# Altium schematic sheet MachSacXa.SchDoc
size A2
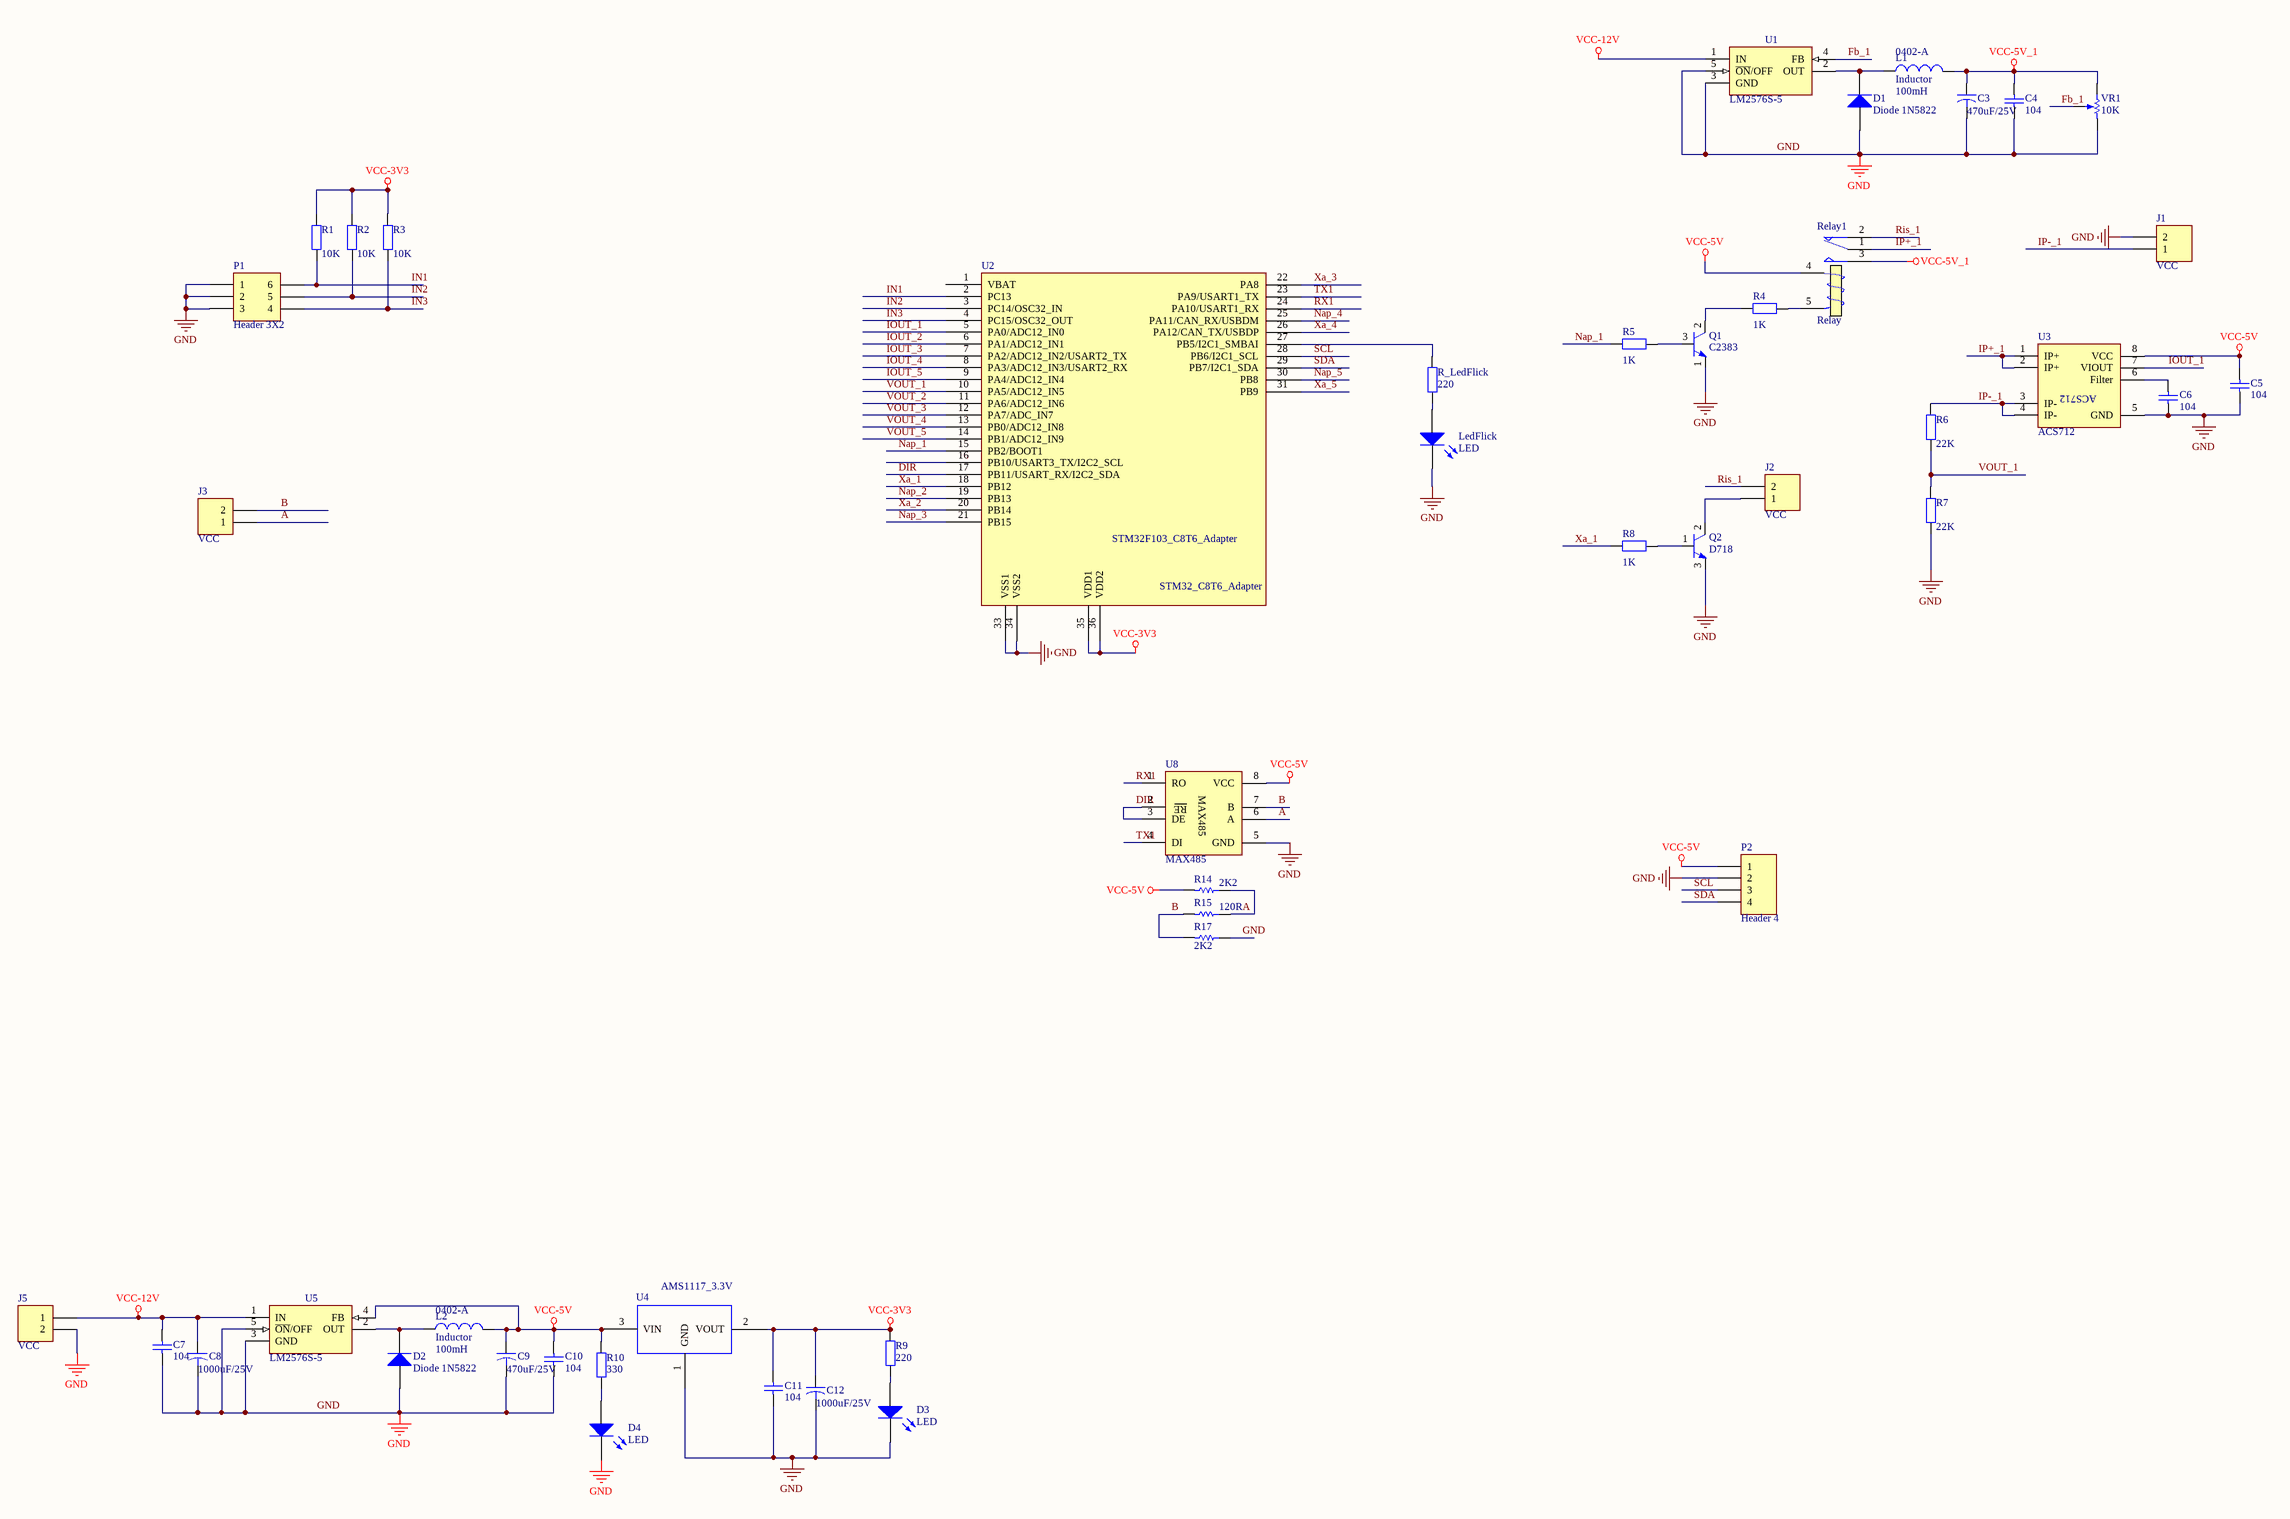
[diagram p0: MachSacXa.SchDoc]

## Parts
C3  value 470uF/25V  [C_D300]
C4  104  [R/C_0805]
C5  104  [R/C_0805]
C6  104  [R/C_0805]
C7  104  [R/C_0805]
C8  value 1000uF/25V  [C_D300]
C9  value 470uF/25V  [C_D300]
C10  104  [R/C_0805]
C11  104  [R/C_0805]
C12  value 1000uF/25V  [C_D300]
D1  Diode 1N5822  [Diode_1A]
D2  Diode 1N5822  [Diode_1A]
D3  LED  [LED_SMD (0805)]
D4  LED  [LED_SMD (0805)]
J1  VCC  [HEADER1_2(400)]
J2  VCC  [HEADER1_2(400)]
J3  VCC  [HEADER1_2(400)]
J5  VCC  [HEADER1_2(400)]
L1  Inductor  value 100mH  PackageReference: 0402-A  [Cuon_cam(100mH)]
L2  Inductor  value 100mH  PackageReference: 0402-A  [Cuon_cam(100mH)]
LedFlick  LED  [LED_SMD (0805)]
P1  Header 3X2  [DIP6_300]
P2  Header 4  [CON-Trang1_4]
Q1  value C2383  [C1815/C945]  (hidden comment: TR_NPN_ECB)
Q2  value D718  [D718]  (hidden comment: TR_NPN_D718)
R1  value 10K  [R/C_0805]
R2  value 10K  [R/C_0805]
R3  value 10K  [R/C_0805]
R4  value 1K  [R/C_0805]
R5  value 1K  [R/C_0805]
R6  value 22K  [R/C_0805]
R7  value 22K  [R/C_0805]
R8  value 1K  [R/C_0805]
R9  value 220  [R/C_0805]
R10  value 330  [R/C_0805]
R14  value 2K2  [R/C_0805]  (hidden comment: Res1)
R15  value 120R  [R/C_0805]  (hidden comment: Res1)
R17  value 2K2  [R/C_0805]  (hidden comment: Res1)
R_LedFlick  value 220  [R/C_0805]
Relay1  Relay  [RL5P_12V7A]
U1  LM2576S-5  [LM2576]
U2  STM32F103_C8T6_Adapter  [Dip36(9x4)]
U3  ACS712  [DS1307]
U4  AMS1117_3.3V  [AMS1117_(SOT_223)]
U5  LM2576S-5  [LM2576]
U8  MAX485  [DIP8_300]
VR1  value 10K  [VR_3]  (hidden comment: Bien tro)

## Nets
GND: C3.2 C4.2 C5.2 C6.2 C7.2 C8.2 C9.2 C10.2 C11.2 C12.2 D1.1(A) D2.1(A) D3.2(K) D4.2(K) J1.2 J5.2 LedFlick.2(K) P1.1 P1.2 P1.3 P2.2 Q1.1(E) Q2.3(B) R7.1 R17.1 U1.3(GND) U1.5(~{ON}/OFF) U2.33(VSS1) U2.34(VSS2) U3.5(GND) U4.1(GND) U5.3(GND) U5.5(~{ON}/OFF) U8.5(GND) VR1.3(TAP)
VCC-3V3: C11.1 C12.1 R1.2 R2.2 R3.2 R9.1 U2.35(VDD1) U2.36(VDD2) U4.2(VOUT)
VCC-5V: C5.1 C9.1 C10.1 L2.2 P2.1 R10.1 R14.2 Relay1.4(T1) U3.8(VCC) U4.3(VIN) U5.4(FB) U8.8(VCC)
VCC-5V_1: C3.1 C4.1 L1.2 Relay1.3(NO) VR1.1(TOP)
VCC-12V: C7.1 C8.1 J5.1 U1.1(IN) U5.1(IN)
A: J3.1 R14.1 R15.1 U8.6(A)
B: J3.2 R15.2 R17.2 U8.7(B)
DIR: U2.17(PB11/USART_RX/I2C2_SDA) U8.2 U8.3(DE)
Fb_1: U1.4(FB) VR1.2(BOT)
IN1: P1.6 R1.1 U2.2(PC13)
IN2: P1.5 R2.1 U2.3(PC14/OSC32_IN)
IN3: P1.4 R3.1 U2.4(PC15/OSC32_OUT)
IOUT_1: U2.5(PA0/ADC12_IN0) U3.7(VIOUT)
IOUT_2: U2.6(PA1/ADC12_IN1)
IOUT_3: U2.7(PA2/ADC12_IN2/USART2_TX)
IOUT_4: U2.8(PA3/ADC12_IN3/USART2_RX)
IOUT_5: U2.9(PA4/ADC12_IN4)
IP+_1: Relay1.1(COM) U3.1(IP+) U3.2(IP+)
IP-_1: J1.1 R6.2 U3.3(IP-) U3.4(IP-)
Nap_1: R5.1 U2.15(PB2/BOOT1)
Nap_2: U2.19(PB13)
Nap_3: U2.21(PB15)
Nap_4: U2.25(PA11/CAN_RX/USBDM)
Nap_5: U2.30(PB8)
Ris_1: J2.2 Relay1.2(NC)
RX1: U2.24(PA10/USART1_RX) U8.1(RO)
SCL: P2.3 U2.28(PB6/I2C1_SCL)
SDA: P2.4 U2.29(PB7/I2C1_SDA)
TX1: U2.23(PA9/USART1_TX) U8.4(DI)
VOUT_1: R6.1 R7.2 U2.10(PA5/ADC12_IN5)
VOUT_2: U2.11(PA6/ADC12_IN6)
VOUT_3: U2.12(PA7/ADC_IN7)
VOUT_4: U2.13(PB0/ADC12_IN8)
VOUT_5: U2.14(PB1/ADC12_IN9)
Xa_1: R8.1 U2.18(PB12)
Xa_2: U2.20(PB14)
Xa_3: U2.22(PA8)
Xa_4: U2.26(PA12/CAN_TX/USBDP)
Xa_5: U2.31(PB9)
NetC6_1: C6.1 U3.6(Filter)
NetD1_2: D1.2(K) L1.1 U1.2(OUT)
NetD2_2: D2.2(K) L2.1 U5.2(OUT)
NetD3_1: D3.1(A) R9.2
NetD4_1: D4.1(A) R10.2
NetJ2_1: J2.1 Q2.2(C)
NetLedFlick_1: LedFlick.1(A) R_LedFlick.2
NetQ1_2: Q1.2(C) R4.1
NetQ1_3: Q1.3(B) R5.2
NetQ2_1: Q2.1(E) R8.2
NetR4_2: R4.2 Relay1.5(T2)
NetR_LedFlick_1: R_LedFlick.1 U2.27(PB5/I2C1_SMBAI)

Not connected (* = marked no-connect by the designer): U2 1(VBAT) 16(PB10/USART3_TX/I2C2_SCL)

## Notes on the sheet
- (in symbol MAX485) RE

## Library data of the parts
C3 C8 C9 C12 = Cap2: Capacitor; Published: 23-Sep-2002; PackageReference: CAPR5-4X5; Publisher: Altium Limited
C4-C7 C10 C11 = Cap: Capacitor; Value: 100pF; Published: 8-Jun-2000; LatestRevisionDate: 17-Jul-2002; LatestRevisionNote: Re-released for DXP Platform.; PackageReference: RAD-0.3; Publisher: Altium Limited
D1 D2 = Diode 1N4004: 1 Amp General Purpose Rectifier; Published: 8-Jun-2000; LatestRevisionDate: 17-Jul-2002; LatestRevisionNote: Re-released for DXP Platform.; DatasheetDocument: 1998; PackageDocument: Aug-1999; PackageReference: DO-41; Publisher: Altium Limited; Code_JEDEC: DO-204-AL; ComponentLink1Description: Manufacturer Link; ComponentLink1URL: http://www.fairchildsemi.com/; ComponentLink2Description: Datasheet; ComponentLink2URL: http://www.fairchildsemi.com/ds/1N%2F1N4001.pdf
D3 D4 LedFlick = LED0: Typical INFRARED GaAs LED; Published: 8-Jun-2000; LatestRevisionDate: 08-Jul-2005; LatestRevisionNote: Mech Layer 1 removed.; PackageReference: LED-0; Publisher: Altium Limited
J1-J3 J5 = Header 2: Header, 2-Pin; LatestRevisionDate: 17-Jul-2002; LatestRevisionNote: Re-released for DXP Platform.; Publisher: Altium Limited
L1 L2 = Inductor: Code_IEC: 1005; Published: 8-Jun-2000; LatestRevisionDate: 17-Jul-2002; LatestRevisionNote: Re-released for DXP Platform.; Publisher: Altium Limited; Code_JEITA: 0402
P1 = Header 3X2: Header, 3-Pin, Dual row; LatestRevisionDate: 17-Jul-2002; LatestRevisionNote: Re-released for DXP Platform.; Publisher: Altium Limited
P2 = Header 4: Header, 4-Pin; LatestRevisionDate: 17-Jul-2002; LatestRevisionNote: Re-released for DXP Platform.; Publisher: Altium Limited
R1-R10 R_LedFlick = Res2: Resistor; Published: 8-Jun-2000; LatestRevisionDate: 17-Jul-2002; LatestRevisionNote: Re-released for DXP Platform.; PackageReference: AXIAL-0.4; Publisher: Altium Limited
R14 R15 R17 = Res1: Resistor; Published: 8-Jun-2000; LatestRevisionDate: 17-Jul-2002; LatestRevisionNote: Re-released for DXP Platform.; PackageReference: AXIAL-0.3; Publisher: Altium Limited
Relay1 = Relay: SPDT Relay; Published: 8-Jun-2000; LatestRevisionDate: 17-Jul-2002; LatestRevisionNote: Re-released for DXP Platform.; PackageReference: MODULE5B; Publisher: Altium Limited
U1 U5 = LM2576S-5.0: Simple Switcher 3A Step Down Voltage Regulator; Note: Tab is connected to GND; Published: 15-Apr-2002; DatasheetVersion: Jun-1999; PackageReference: TS5B; Publisher: Altium Limited; PackageDescription: D2-PAK; 5 Leads; Body 14.4 (inc. leads) x 10.4 mm (LxW max); ComponentLink1Description: Manufacturer Link; ComponentLink1URL: http://www.national.com/; ComponentLink2Description: Datasheet; ComponentLink2URL: http://www.national.com/ds.cgi/LM/LM2576.pdf; ComponentLink3Description: URL Link1; ComponentLink3URL: http://www.national.com/pf/LM/LM2576.html
U2 = STM32_C8T6_Adapter
VR1 = VR